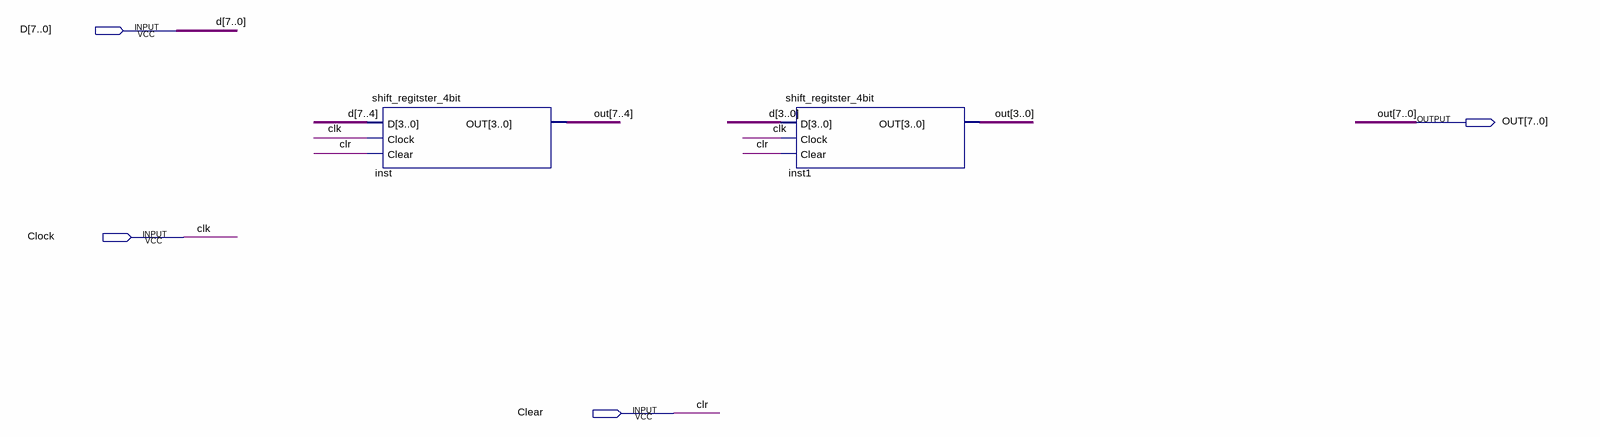
[diagram p0: schematic sheet]
// Quartus schematic reg_8bit.bdf as structural Verilog: 2 symbols, 4 pins
module reg_8bit (
  input  [7:0] D,
  input  Clock,
  input  Clear,
  output [7:0] OUT
);

  shift_regitster_4bit inst (.D(D[7:4]), .Clock(Clock), .Clear(Clear), .OUT(OUT[7:4]));
  shift_regitster_4bit inst1 (.D(D[3:0]), .Clock(Clock), .Clear(Clear), .OUT(OUT[3:0]));

  // Other names for the same wires on the sheet: clk = Clock; clr = Clear
endmodule
